# EAGLE design ESP12_BusinessCard (EAGLE 9.5.0)
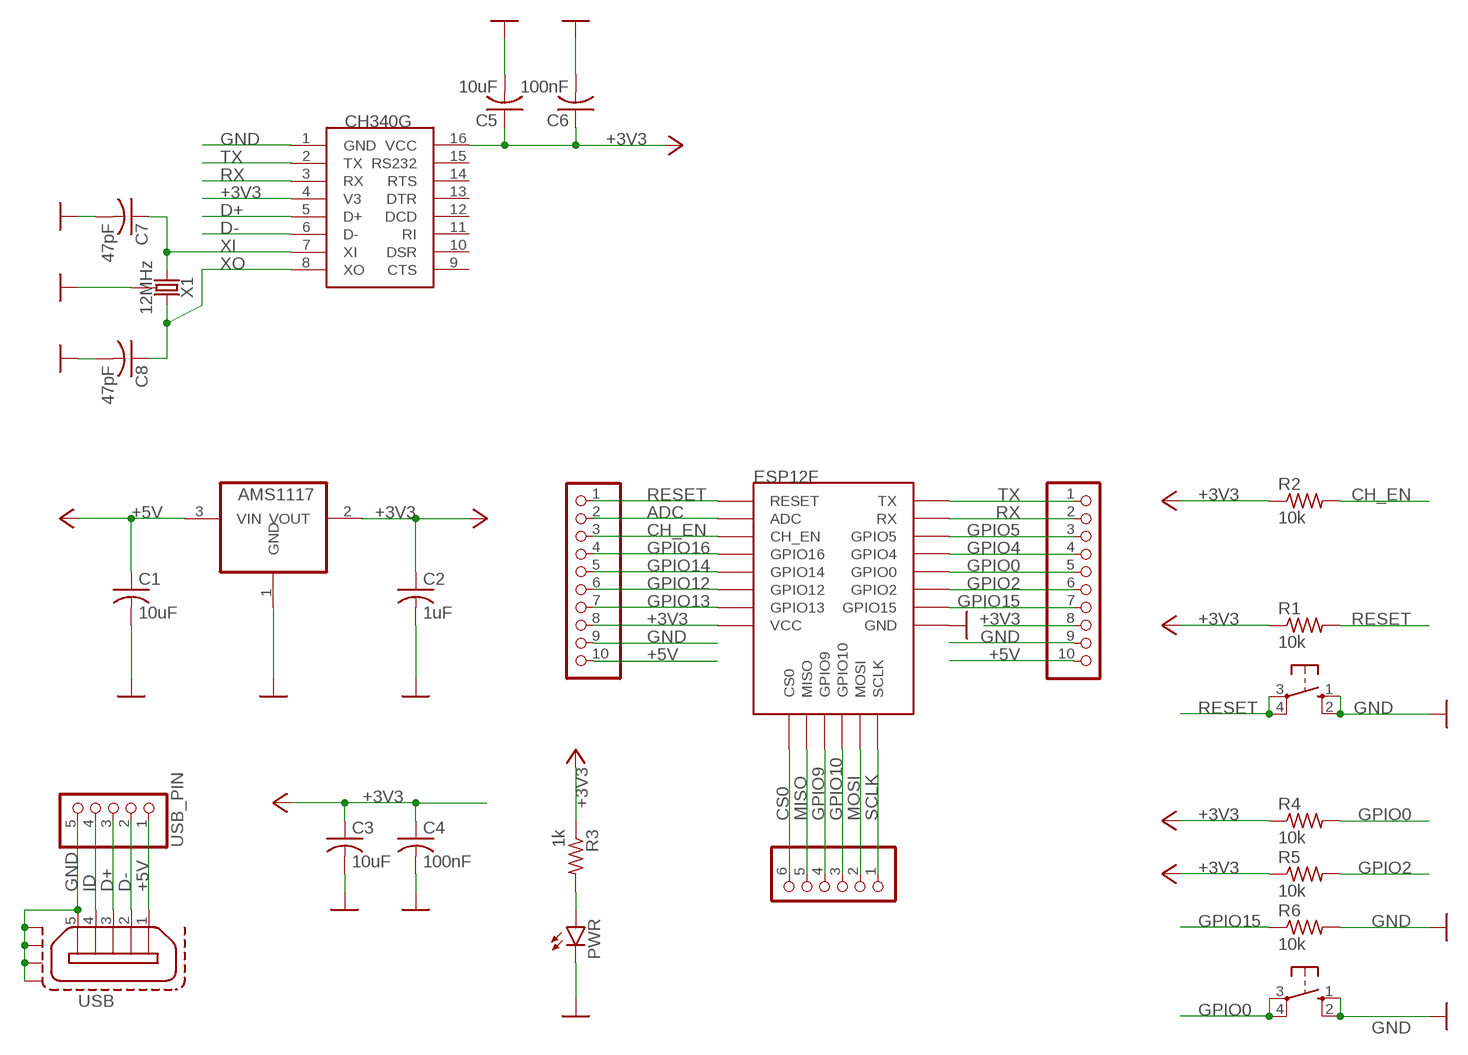
[diagram p0: schematic, sheet 1]

## Parts
AMS1117  AMS1117  REG1117  [SOT223]
C1  10uF  C-USC0805  [C0805]
C2  1uF  C-USC0805  [C0805]
C3  10uF  C-USC0805  [C0805]
C4  100nF  C-USC0805  [C0805]
C5  10uF  C-USC0805  [C0805]
C6  100nF  C-USC0805  [C0805]
C7  47pF  C-USC0805  [C0805]
C8  47pF  C-USC0805  [C0805]
CH340G  CH340G  [SOIC16]
ESP12F  ESP12FSMD  [ESP12E-SMD]
JP1  PINHD-1X10  [1X10]
JP2  PINHD-1X10  [1X10]
JP3  PINHD-1X6  [1X06]
PWR  LEDCHIP-LED0603  [CHIP-LED0603]
R1  10k  R-US_R0805  [R0805]
R2  10k  R-US_R0805  [R0805]
R3  1k  R-US_R0805  [R0805]
R4  10k  R-US_R0805  [R0805]
R5  10k  R-US_R0805  [R0805]
R6  10k  R-US_R0805  [R0805]
S_PROG  10-XX  [B3F-10XX]
S_RESET  10-XX  [B3F-10XX]
USB  ZX62D-B-5PA8  [ZX62D-B-5PA8]
USB_PIN  PINHD-1X5  [1X05]
X1  12MHz  CRYSTAL-GROUNDEDSMD-3.2X2.5  [CRYSTAL-SMD-3.2X2.5MM]

## Nets
+3V3: AMS1117.2(VOUT) C2.1 C3.1 C4.1 C5.1 C6.1 CH340G.4(V3) CH340G.16(VCC) ESP12F.VCC JP1.8 JP2.8 R1.1 R2.1 R3.1 R4.1 R5.1
+5V: AMS1117.3(VIN) C1.1 JP1.10 JP2.10 USB.1 USB_PIN.1
ADC: ESP12F.ADC JP1.2
CH_EN: ESP12F.CH_PD(CH_EN) JP1.3 R2.2
CS0: ESP12F.CS0 JP3.6
D+: CH340G.5(D+) USB.3 USB_PIN.3
D-: CH340G.6(D-) USB.2 USB_PIN.2
GND: AMS1117.1(GND) C1.2 C2.2 C3.2 C4.2 C5.2 C6.2 C7.2 C8.2 CH340G.1(GND) ESP12F.GND JP1.9 JP2.9 PWR.C R6.2 S_PROG.1(S) S_PROG.2(S1) S_RESET.1(S) S_RESET.2(S1) USB.5 USB.S1 USB.S2 USB.S3 USB.S4 USB_PIN.5 X1.2 X1.4
GPIO0: ESP12F.GPIO0 JP2.5 R4.2 S_PROG.3(P) S_PROG.4(P1)
GPIO2: ESP12F.GPIO2 JP2.6 R5.2
GPIO4: ESP12F.GPIO4 JP2.4
GPIO5: ESP12F.GPIO5 JP2.3
GPIO9: ESP12F.GPIO9 JP3.4
GPIO10: ESP12F.GPIO10 JP3.3
GPIO12: ESP12F.GPIO12 JP1.6
GPIO13: ESP12F.GPIO13 JP1.7
GPIO14: ESP12F.GPIO14 JP1.5
GPIO15: ESP12F.GPIO15 JP2.7 R6.1
GPIO16: ESP12F.GPIO16 JP1.4
ID: USB.4 USB_PIN.4
MISO: ESP12F.MISO JP3.5
MOSI: ESP12F.MOSI JP3.2
N$1: PWR.A R3.2
RESET: ESP12F.RESET JP1.1 R1.2 S_RESET.3(P) S_RESET.4(P1)
RX: CH340G.3(RX) ESP12F.RXD0(RX) JP2.2
SCLK: ESP12F.SCLK JP3.1
TX: CH340G.2(TX) ESP12F.TXD0(TX) JP2.1
XI: C7.1 CH340G.7(XI) X1.1
XO: C8.1 CH340G.8(XO) X1.3
Unconnected: CH340G.9(CTS) CH340G.10(DSR) CH340G.11(RI) CH340G.12(DCD) CH340G.13(DTR) CH340G.14(RTS) CH340G.15(RS232)

## Library data of the parts
AMS1117 = burr-brown:REG1117: 800mA and 1A Low Dropout (LDO) Positive Regulator 1.8V, 2.5V, 2.85V, 3.3V, 5V, and Adj; LCSC: C6186; MPN: REG1117; OC_FARNELL: 1097566; OC_NEWARK: 14P6981
C1 C3 C5 = rcl:C-US: CAPACITOR, American symbol; LCSC: C15850; SPICEPREFIX: C
C2 = rcl:C-US: CAPACITOR, American symbol; LCSC: C28323; SPICEPREFIX: C
C4 C6 = rcl:C-US: CAPACITOR, American symbol; LCSC: C49678; SPICEPREFIX: C
C7 C8 = rcl:C-US: CAPACITOR, American symbol; LCSC: C14857; SPICEPREFIX: C
CH340G = ESP8266_BusinessCard:CH340G; LCSC: C14267
ESP12F = ESP8266_BusinessCard:ESP12F: ESP12E Module
JP1 JP2 = pinhead:PINHD-1X10: PIN HEADER
JP3 = pinhead:PINHD-1X6: PIN HEADER
PWR = led:LED: LED OSRAM: - CHIPLED LG R971, LG N971, LY N971, LG Q971, LY Q971, LO R971, LY R971 LH N974, LH R974 LS Q976, LO Q976, LY Q976 LO Q996 - Hyper CHIPLED LW Q18S LB Q993, LB Q99A, LB R99A - SideLED LS A670, LO A670, LY A670, LG A670, LP A670 LB A673, LV A673, LT A673, LW A673 LH A674 LY A675 LS A676, LA A676, LO A676, LY A676, LW A676 LS A679, LY A679, LG A679 - Hyper Micro SIDELED® LS Y876, LA Y876, LO Y876, LY Y876 LT Y87S - SmartLED LW L88C, LW L88S LB L89C, LB L89S, LG L890 LS L89K, LO L89K, LY L89K LS L896, LA L896, LO L896, LY L896 - TOPLED LS T670, LO T670, LY T670, LG T670, LP T670 LSG T670, LSP T670, LSY T670, LOP T670, LYG T670 LG T671, LOG T671, LSG T671 LB T673, LV T673, LT T673, LW T673 LH T674 LS T676, LA T676, LO T676, LY T676, LB T676, LH T676, LSB T676, LW T676 LB T67C, LV T67C, LT T67C, LS T67K, LO T67K, LY T67K, LW E67C LS E67B, LA E67B, LO E67B, LY E67B, LB E67C, LV E67C, LT E67C LW T67C LS T679, LY T679, LG T679 LS T770, LO T770, LY T770, LG T770, LP T770 LB T773, LV T773, LT T773, LW T773 LH T774 LS E675, LA E675, LY E675, LS T675 LS T776, LA T776, LO T776, LY T776, LB T776 LHGB T686 LT T68C, LB T68C - Hyper Mini TOPLED® LB M676 - Mini TOPLED Santana® LG M470 LS M47K, LO M47K, LY M47K Source: http://www.osram.convergy.de LUXEON: - LUMILED® LXK2-PW12-R00, LXK2-PW12-S00, LXK2-PW14-U00, LXK2-PW14-V00 LXK2-PM12-R00, LXK2-PM12-S00, LXK2-PM14-U00 LXK2-PE12-Q00, LXK2-PE12-R00, LXK2-PE12-S00, LXK2-PE14-T00, LXK2-PE14-U00 LXK2-PB12-K00, LXK2-PB12-L00, LXK2-PB12-M00, LXK2-PB14-N00, LXK2-PB14-P00, LXK2-PB14-Q00 LXK2-PR12-L00, LXK2-PR12-M00, LXK2-PR14-Q00, LXK2-PR14-R00 LXK2-PD12-Q00, LXK2-PD12-R00, LXK2-PD12-S00 LXK2-PH12-R00, LXK2-PH12-S00 LXK2-PL12-P00, LXK2-PL12-Q00, LXK2-PL12-R00 Source: www.luxeon.com KINGBRIGHT: KA-3528ASYC Source: www.kingbright.com; LCSC: C2286
R1 R2 R4-R6 = rcl:R-US_: RESISTOR, American symbol; LCSC: C17414; SPICEPREFIX: R
R3 = rcl:R-US_: RESISTOR, American symbol; LCSC: C17513; SPICEPREFIX: R
S_PROG S_RESET = switch-omron:10-XX: OMRON SWITCH; MPN: B3F-1000; OC_FARNELL: 176432; OC_NEWARK: 36M3542
USB = ESP8266_BusinessCard:ZX62D-B-5PA8: Micro USB Type B Connector - Standard, Shell Through Hole Source: http://www.hirose.co.jp/cataloge_hp/ed_ZX_20140804.pdf; MF: Hirose; MPN: ZX62D-B-5PA8; OC_FARNELL: 2300438; OC_NEWARK: 69W0712
USB_PIN = pinhead:PINHD-1X5: PIN HEADER
X1 = ESP8266_BusinessCard:CRYSTAL-GROUNDED: Crystals w/ Ground Pin (Generic) These are passive quartz crystals, which can be used as a clock source for a microcontroller. Crystal's are usually two-terminal devices. A third terminal may be optionally connected to ground, as recommended by the manufaturer.; LCSC: C9002

## Board
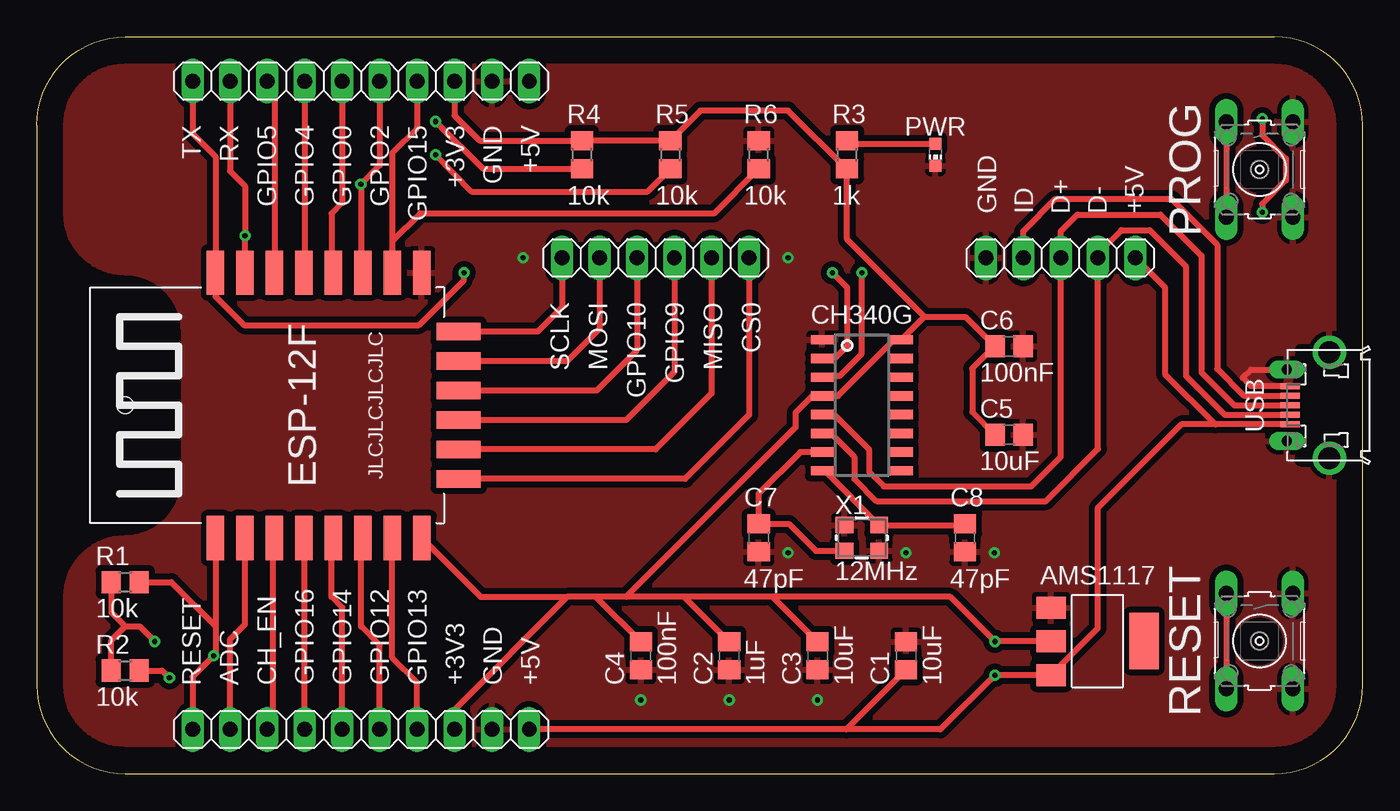
[diagram p1: board, top side]
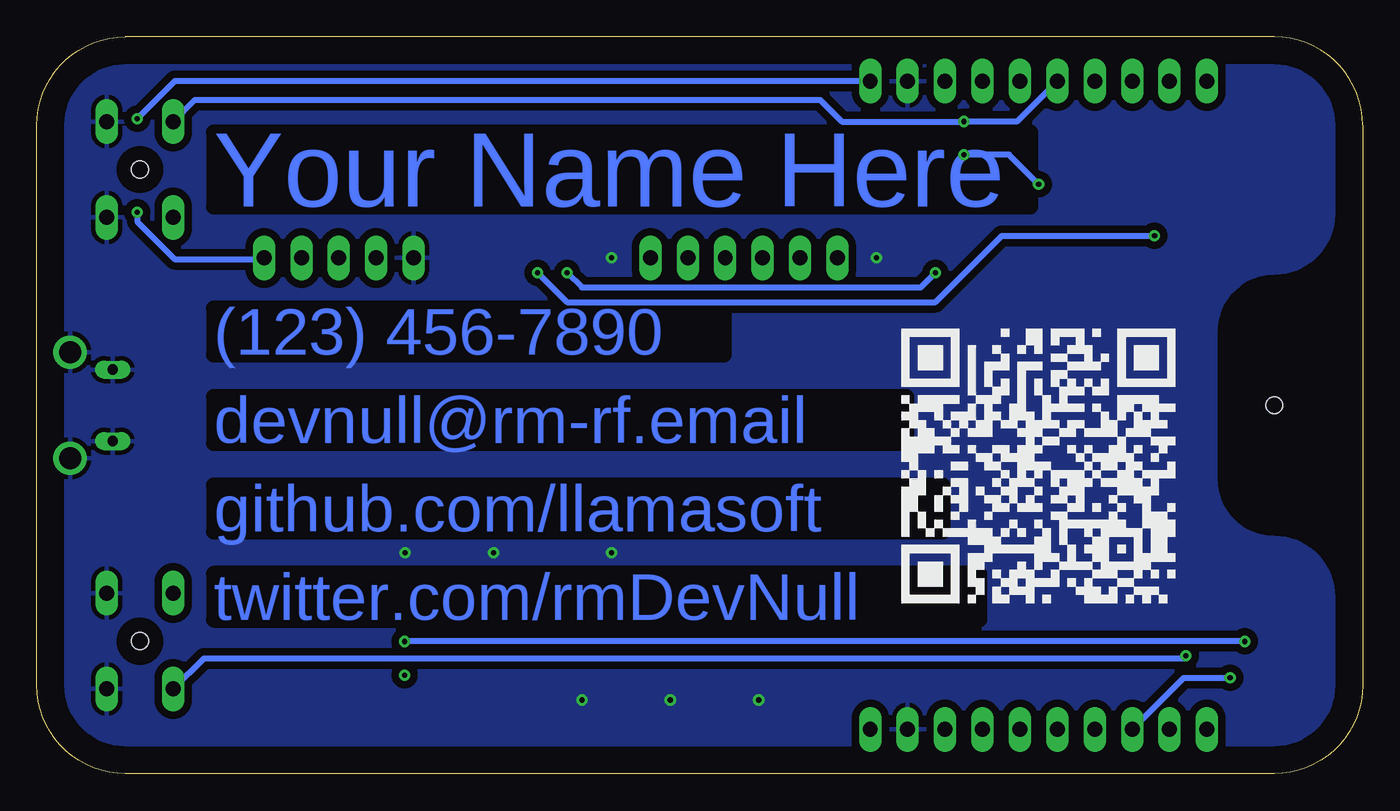
[diagram p2: board, bottom side, seen from below]

Size 90 x 50 mm. Coordinates in mm from the lower left corner, seen from the top.
Outline: 6,0 84,0 arc90 90,6 90,44 arc90 84,50 6,50 arc90 0,44 0,6 arc90 6,0
Copper layers (1*16): Top 0.035mm / dielectric 1.5mm / Bottom 0.035mm
Design rules "default *": minimum track width 6mil, minimum drill 0.35mm, track to track 6mil, track to pad 6mil, pad to pad 6mil, via to via 6mil, smd to smd 6mil, copper to edge 40mil, drill to drill 6mil, minimum pad ring 10mil, minimum via ring 8mil, stop-mask expansion 4mil, vias tented up to drill 0mil, thermal gap 12mil
Holes 1.15 mm at 6,25 83,9 83,41

### Footprints (pad centres in the part's own frame; a part is rotated, then mirrored left to right if it is on the bottom)
SOT223 = smd 1.499 x 2.007: 1 -2.261,-3.15; 2 0.025,-3.15; 3 2.311,-3.15 | smd 3.81 x 2.007: 4 0,3.15
C0805 = smd 1.3 x 1.5: 1 -0.95,0; 2 0.95,0
SOIC16 = smd 0.635 x 1.524: 1 -4.445,-2.695; 2 -3.175,-2.695; 3 -1.905,-2.695; 4 -0.635,-2.695; 5 0.635,-2.695; 6 1.905,-2.695; 7 3.175,-2.695; 8 4.445,-2.695; 9 4.445,2.695; 10 3.175,2.695; 11 1.905,2.695; 12 0.635,2.695; 13 -0.635,2.695; 14 -1.905,2.695; 15 -3.175,2.695; 16 -4.445,2.695
ESP12E-SMD = smd 3 x 1.2: ADC -9,4; CH_PD -9,2; GND 9,-8; GPIO0 9,-2; GPIO2 9,-4; GPIO4 9,0; GPIO5 9,2; GPIO12 -9,-4; GPIO13 -9,-6; GPIO14 -9,-2; GPIO15 9,-6; GPIO16 -9,0; RESET -9,6; RXD0 9,4; TXD0 9,6; VCC -9,-8 | smd 1.2 x 3: CS0 -5,-10.5; GPIO9 -1,-10.5; GPIO10 1,-10.5; MISO -3,-10.5; MOSI 3,-10.5; SCLK 5,-10.5
1X10 = drill 1.016 long: 1 -11.43,0; 2 -8.89,0; 3 -6.35,0; 4 -3.81,0; 5 -1.27,0; 6 1.27,0; 7 3.81,0; 8 6.35,0; 9 8.89,0; 10 11.43,0
1X06 = drill 1.016 long: 1 -6.35,0; 2 -3.81,0; 3 -1.27,0; 4 1.27,0; 5 3.81,0; 6 6.35,0
CHIP-LED0603 = smd 0.8 x 0.8: A 0,-0.75; C 0,0.75
R0805 = smd 1.3 x 1.5: 1 -0.95,0; 2 0.95,0
B3F-10XX = drill 1.016 long: 1 -3.251,2.261; 2 3.251,2.261; 3 -3.251,-2.261; 4 3.251,-2.261
ZX62D-B-5PA8 = smd 1.35 x 0.4: 1 4.825,1.3; 2 4.825,0.65; 3 4.825,0; 4 4.825,-0.65; 5 4.825,-1.3 | drill 1.5: S1 2.15,-3.6; S2 2.15,3.6 | drill 0.7 long: S3 5.05,2.425; S4 5.05,-2.425
1X05 = drill 1.016 long: 1 -5.08,0; 2 -2.54,0; 3 0,0; 4 2.54,0; 5 5.08,0
CRYSTAL-SMD-3.2X2.5MM = smd 1.2 x 1.1: 1 -1.175,-0.875; 2 1.175,-0.875; 3 1.175,0.875; 4 -1.175,0.875

### Placement (x,y rotation side)
AMS1117  72,9 270 top
C1  59,8 90 top
C2  47,8 270 top
C3  53,8 270 top
C4  41,8 270 top
C5  66,23 0 top
C6  66,29 0 top
C7  49,16 270 top
C8  63,16 270 top
CH340G  56,25 270 top
ESP12F  18.13,25 90 top
JP1  22,3 0 top
JP2  22,47 0 top
JP3  42,35 0 top
PWR  61,42 180 top
R1  6,13 0 top
R2  6,7 0 top
R3  55,42 90 top
R4  37,42 270 top
R5  43,42 270 top
R6  49,42 90 top
S_PROG  83,41 270 top
S_RESET  83,9 270 top
USB  89.89,25 180 top
USB_PIN  69.5,35 180 top
X1  56,16 0 top

### Tracks (layer width: path | path; a pad name or v marks a point on that pad's centre or on a via)
+3V3  (via drill 0.35)
  Top 0.406: AMS1117.2 v65.03,8.97 62,12 50,12 | JP1.8 28.35,4.35 36,12 | 50,12 44,12 | 44,12 40,12 | 40,12 38,12 | 38,12 36,12 | C3.1 50,11.95 50,12 | C2.1 44,11.95 44,12 | C4.1 38,11.95 38,12 | ESP12F.VCC 30.13,12 36,12 | JP2.8 28.35,44.65 30.05,42.95 R4.1 R5.1 45.05,45 51,45 54.95,41.05 R3.1 55,36.25 60.25,31 | v8,8.97 6.97,10 6,10 | R1.1 5.05,10.95 6,10 | R2.1 5.05,9.05 6,10 | 40,12 51.5,23.5 51.5,24.5 52.63,25.64 CH340G.4 54.38,25.64 58.2,29.45 CH340G.16 60.25,31 | C5.1 63.5,24.55 63.5,27.5 65,29 C6.1 63.05,31 60.25,31
  Bottom 0.406: v8,8.97 v65.03,8.97
+5V  (via drill 0.35)
  Top 0.406: 54.95,3 61.34,3 v65.03,6.69 AMS1117.3 72,9.84 72,18 77.7,23.7 80,23.7 | 54.95,3 JP1.10 | C1.1 54.95,3 | USB.1 80,23.7 | USB_PIN.1 76.58,33 76.58,27.12 80,23.7 | v83.19,44.45 83.19,43.35 84.8,41.74 84.8,40.26 83.19,38.65 v83.19,38.1
  Bottom 0.406: JP2.10 80.64,47 v83.19,44.45 | v83.19,38.1 83.19,37.47 80.64,34.92 74.66,34.92 USB_PIN.1
ADC
  Top 0.406: JP1.2 13.11,9.11 14.13,10.13 ESP12F.ADC
CH_EN  (via drill 0.35)
  Top 0.406: ESP12F.CH_PD 16,15.87 16,3.35 JP1.3 | R2.2 8.5,7 v9,6.5
  Bottom 0.406: JP1.3 12.15,6.5 v9,6.5
CS0
  Top 0.406: JP3.6 48.35,24.35 44,20 ESP12F.CS0
D+
  Top 0.406: CH340G.5 54.13,24.36 56.5,22 56.5,20.5 57.5,19.5 67.5,19.5 69.5,21.5 USB_PIN.3 69.5,36.8 70.64,37.94 76.27,37.94 79.06,35.15 79.06,27.23 81.29,25 USB.3
D-
  Top 0.406: CH340G.6 53.4,23 54,23 55.5,21.5 55.5,20 57,18.5 68.5,18.5 72.04,22.04 USB_PIN.2 72.04,35.3 73.62,36.88 75.54,36.88 78,34.42 78,27 80.65,24.35 USB.2
GND  (via drill 0.35)
  Top 0.406: USB.5 82.4,26.3 81.85,26.85 82.42,27.43 USB.S4
  other vias: 53,5 47,5 41,5 65,15 51,15 59,15 51,35 33,35
  pour Top (isolate 0.406): 6,48 84,48 arc-90 88,44 88,12 88,6 arc-90 84,2 6,2 arc-90 2,6 2,12 arc-90 6,16 arc90 10,20 10,30 arc90 6,34 arc-90 2,38 2,44 arc-90
  pour Bottom (isolate 0.508): 6,48 84,48 arc-90 88,44 88,6 arc-90 84,2 6,2 arc-90 2,6 2,12 arc-90 6,16 arc90 10,20 10,30 arc90 6,34 arc-90 2,38 2,44 arc-90
GPIO0  (via drill 0.35)
  Top 0.406: ESP12F.GPIO0 20,34.13 20,38 20.73,38.73 20.73,42 JP2.5 | S_PROG.3 S_PROG.4 | v27.08,44.25 30.28,41.05 R4.2
  Bottom 0.406: S_PROG.3 79.27,45.72 36.83,45.72 35.36,44.25 v27.08,44.25 23.48,44.25 JP2.5
GPIO2  (via drill 0.35)
  Top 0.406: JP2.6 23.27,41.27 v22,40 22,34.13 ESP12F.GPIO2 | v27.08,42 29.5,39.5 41.45,39.5 R5.2
  Bottom 0.406: v22,40 24,42 v27.08,42
GPIO4
  Top 0.406: JP2.4 18.19,34.06 ESP12F.GPIO4
GPIO5
  Top 0.406: JP2.3 16.13,46.52 ESP12F.GPIO5
GPIO9
  Top 0.406: JP3.4 43.27,27.27 40,24 ESP12F.GPIO9
GPIO10
  Top 0.406: JP3.3 40.73,28.73 38,26 ESP12F.GPIO10
GPIO12
  Top 0.406: JP1.6 23.27,8.73 22,10 22,15.87 ESP12F.GPIO12
GPIO13
  Top 0.406: JP1.7 25.81,6.19 24.13,7.87 ESP12F.GPIO13
GPIO14
  Top 0.406: JP1.5 20.73,11.27 20,12 20,15.87 ESP12F.GPIO14
GPIO15
  Top 0.406: JP2.7 25.81,43.81 24.13,42.13 ESP12F.GPIO15 24.13,36.13 26,38 45.95,38 R6.1
GPIO16
  Top 0.406: JP1.4 18.19,15.94 ESP12F.GPIO16
ID
  Top 0.406: USB_PIN.4 66.96,36.8 69.16,39 77.01,39 80.12,35.88 80.12,27.46 81.93,25.65 USB.4
MISO
  Top 0.406: JP3.5 45.81,25.81 42,22 ESP12F.MISO
MOSI
  Top 0.406: JP3.2 38.19,30.19 36,28 ESP12F.MOSI
N$1
  Top 0.406: R3.2 55.2,42.75 PWR.A
RESET  (via drill 0.35)
  Top 0.406: ESP12F.RESET 12.13,10 | 12.13,10 12.13,8.13 v12,8 10.57,6.57 JP1.1 | R1.2 9.13,13 12.13,10 | S_RESET.3 S_RESET.4
  Bottom 0.406: v12,8 12.17,7.83 78.66,7.83 S_RESET.4
RX  (via drill 0.35)
  Top 0.406: JP2.2 13.11,40.89 14.13,39.87 v14.13,36.5 ESP12F.RXD0 | CH340G.3 53.4,27 54.5,27 56,28.5 v56,34
  Bottom 0.406: v56,34 54,32 29,32 24.5,36.5 v14.13,36.5
SCLK
  Top 0.406: JP3.1 35.65,31.65 34,30 ESP12F.SCLK
TX  (via drill 0.35)
  Top 0.406: JP2.1 10.57,43.43 12.13,41.87 ESP12F.TXD0 12.13,32.37 14.06,30.44 25.94,30.44 29,33.5 v29,34 | CH340G.2 54.17,28.18 55,29 55,33 v54,34
  Bottom 0.406: v54,34 53,33 30,33 v29,34
XI
  Top 0.406: X1.1 52.88,15.12 51.05,16.95 C7.1 49,19 51.83,21.82 CH340G.7
XO
  Top 0.406: C8.1 62.92,16.88 X1.3 53.49,20.55 CH340G.8

### Text on the board
Bottom: Your Name Here | (123) 456-7890 | devnull@rm-rf.email | github.com/llamasoft | twitter.com/rmDevNull
tNames: TX | RX | GPIO5 | GPIO4 | GPIO0 | GPIO2 | GPIO15 | +3V3 | GND | +5V | PROG | GND | ID | D+ | D- | +5V | SCLK | MOSI | GPIO10 | GPIO9 | MISO | CS0 | ESP-12F | JLCJLCJLCJLC | RESET | RESET | ADC | CH_EN | GPIO16 | GPIO14 | GPIO12 | GPIO13 | +3V3 | GND | +5V
bStop: Your Name Here | (123) 456-7890 | devnull@rm-rf.email | github.com/llamasoft | twitter.com/rmDevNull